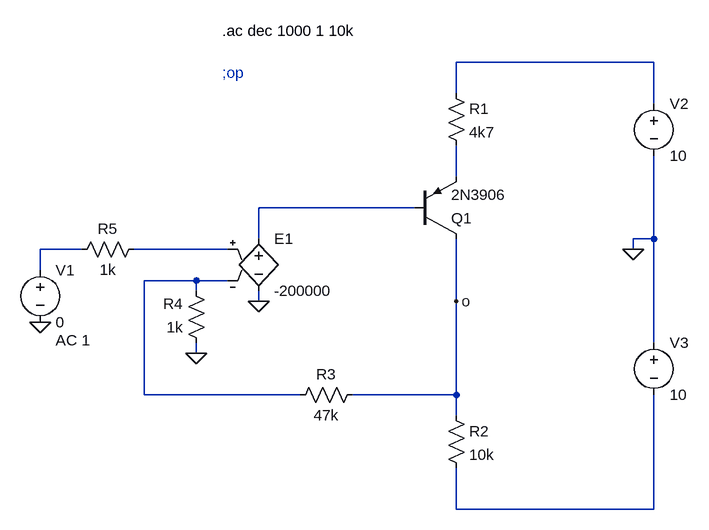
[diagram p0: schematic parcial 1 e1 2024.asc]
parcial 1 e1 2024.asc, the LTspice schematic file:
Version 4
SHEET 1 880 680
WIRE 816 -208 512 -208
WIRE 512 -160 512 -208
WIRE 816 -144 816 -208
WIRE 512 -32 512 -80
WIRE 448 16 208 16
WIRE 208 64 208 16
WIRE 816 64 816 -64
WIRE 816 64 784 64
WIRE -64 80 -128 80
WIRE 160 80 16 80
WIRE 784 80 784 64
WIRE -128 112 -128 80
WIRE 112 128 32 128
WIRE 160 128 112 128
WIRE 112 144 112 128
WIRE 208 160 208 144
WIRE 512 160 512 64
WIRE 816 224 816 64
WIRE 112 240 112 224
WIRE 32 304 32 128
WIRE 272 304 32 304
WIRE 512 304 512 160
WIRE 512 304 352 304
WIRE 512 336 512 304
WIRE 512 480 512 416
WIRE 816 480 816 304
WIRE 816 480 512 480
FLAG 208 160 0
FLAG 784 80 0
FLAG -128 192 0
FLAG 112 240 0
FLAG 512 160 o
SYMBOL e 208 48 R0
SYMATTR InstName E1
SYMATTR Value -200000
SYMBOL pnp 448 64 M180
SYMATTR InstName Q1
SYMATTR Value 2N3906
SYMBOL res 496 -176 R0
SYMATTR InstName R1
SYMATTR Value 4k7
SYMBOL res 496 320 R0
SYMATTR InstName R2
SYMATTR Value 10k
SYMBOL res 368 288 R90
WINDOW 0 0 56 VBottom 2
WINDOW 3 32 56 VTop 2
SYMATTR InstName R3
SYMATTR Value 47k
SYMBOL res 128 240 R180
WINDOW 0 36 76 Left 2
WINDOW 3 36 40 Left 2
SYMATTR InstName R4
SYMATTR Value 1k
SYMBOL res 32 64 R90
WINDOW 0 0 56 VBottom 2
WINDOW 3 32 56 VTop 2
SYMATTR InstName R5
SYMATTR Value 1k
SYMBOL voltage -128 96 R0
WINDOW 123 24 124 Left 2
WINDOW 39 0 0 Left 0
SYMATTR InstName V1
SYMATTR Value 0
SYMATTR Value2 AC 1
SYMBOL voltage 816 -160 R0
WINDOW 123 0 0 Left 0
WINDOW 39 0 0 Left 0
SYMATTR InstName V2
SYMATTR Value 10
SYMBOL voltage 816 208 R0
WINDOW 123 0 0 Left 0
WINDOW 39 0 0 Left 0
SYMATTR InstName V3
SYMATTR Value 10
TEXT 152 -192 Left 2 ;;op
TEXT 152 -256 Left 2 !.ac dec 1000 1 10k

The netlist it stands for:
* parcial 1 e1 2024.asc
E1 N003 0 N005 N006 -200000
Q1 o N003 N002 0 2N3906
R1 N001 N002 4k7
R2 o N007 10k
R3 o N006 47k
R4 0 N006 1k
R5 N005 N004 1k
V1 N004 0 0 AC 1
V2 N001 0 10
V3 0 N007 10
.model NPN NPN
.model PNP PNP
.lib standard.bjt
* ;op
.ac dec 1000 1 10k
.backanno
.end